# EAGLE design boil_buddy (EAGLE 9.6.2)
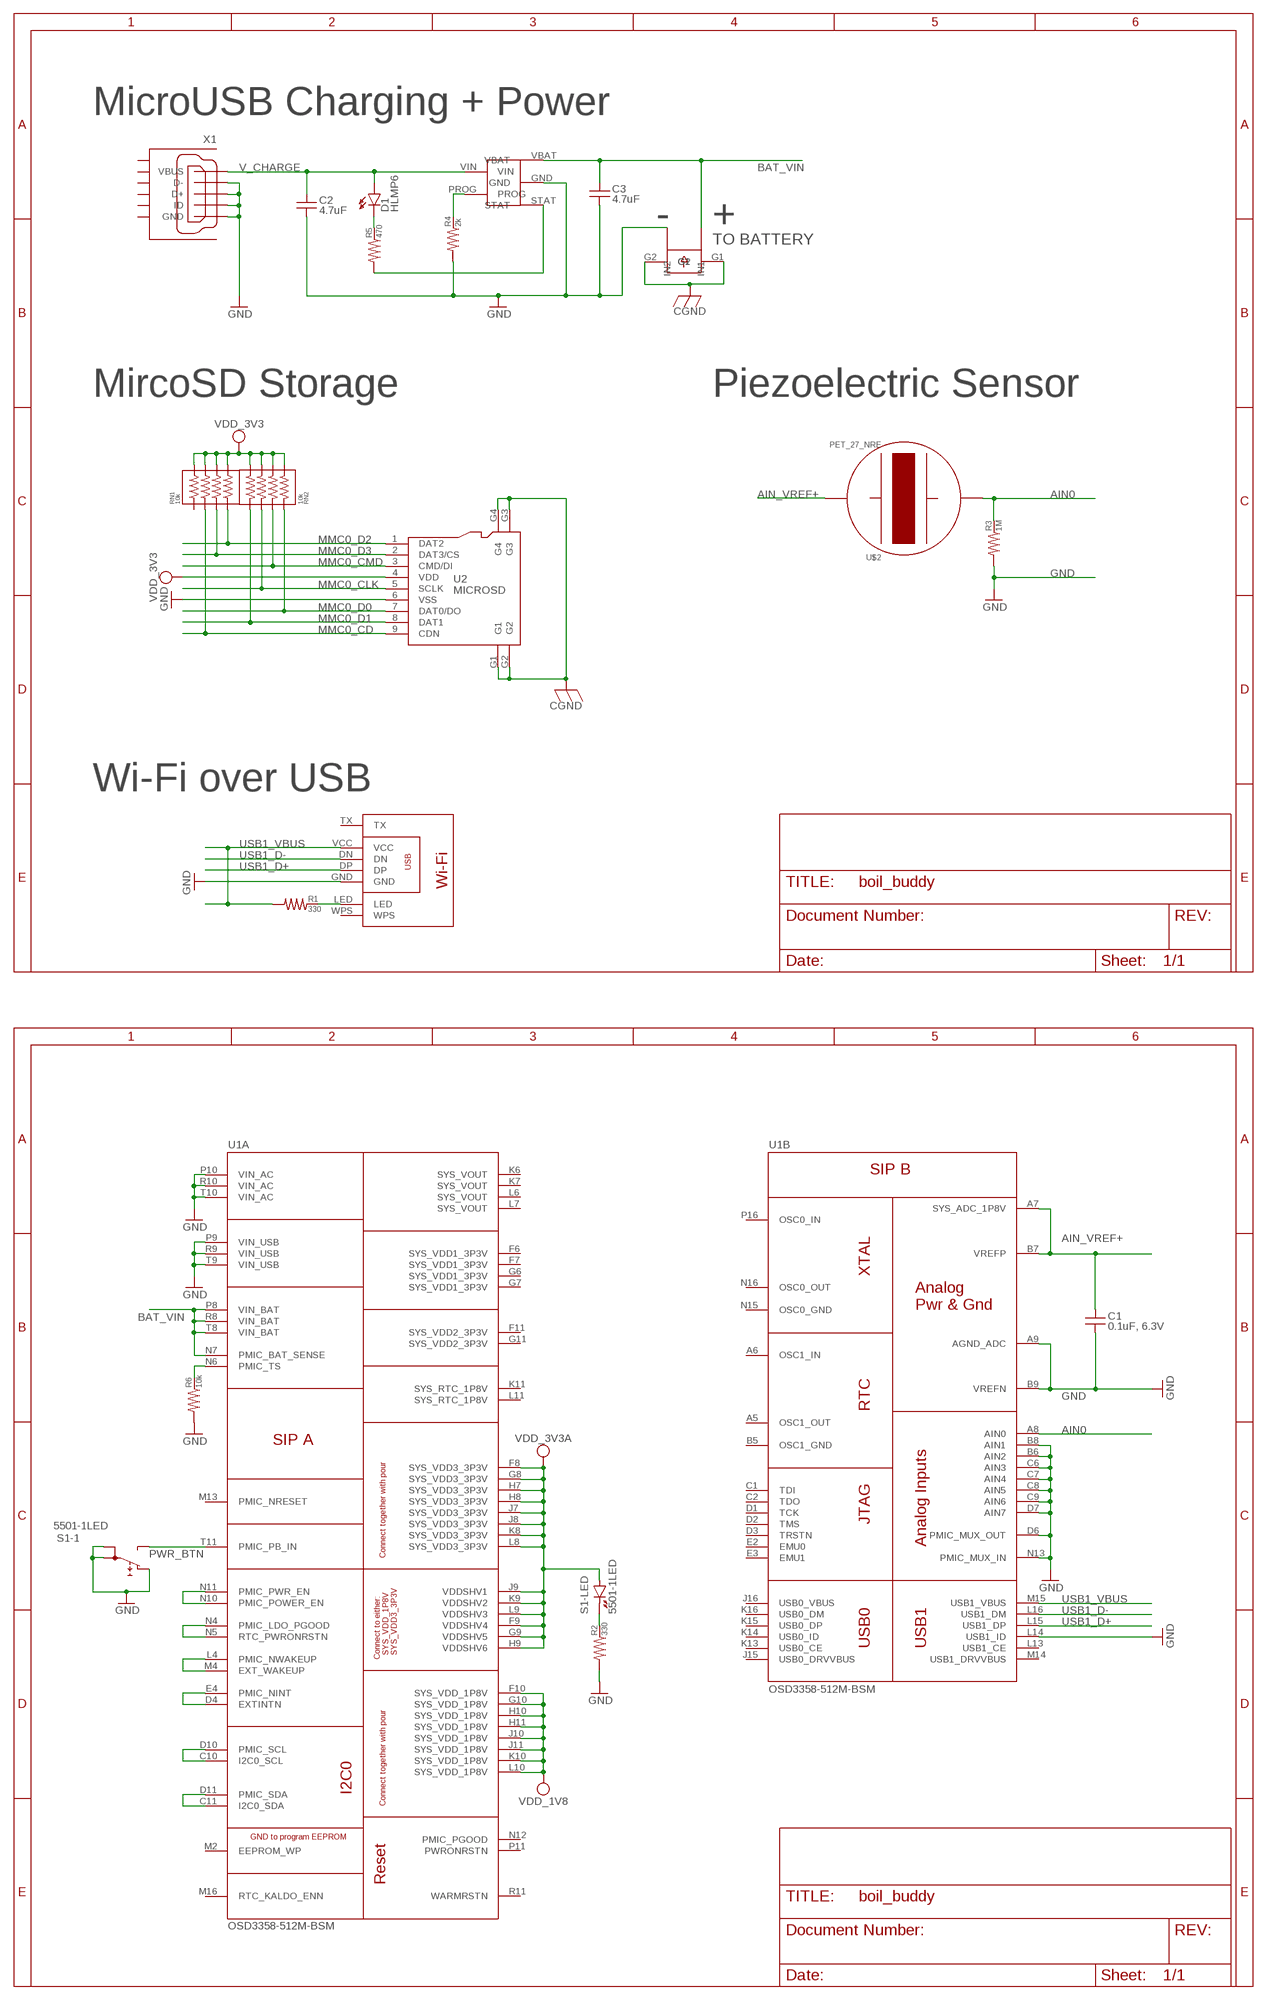
[diagram p0: schematic, sheet 1, part 1 of 2]
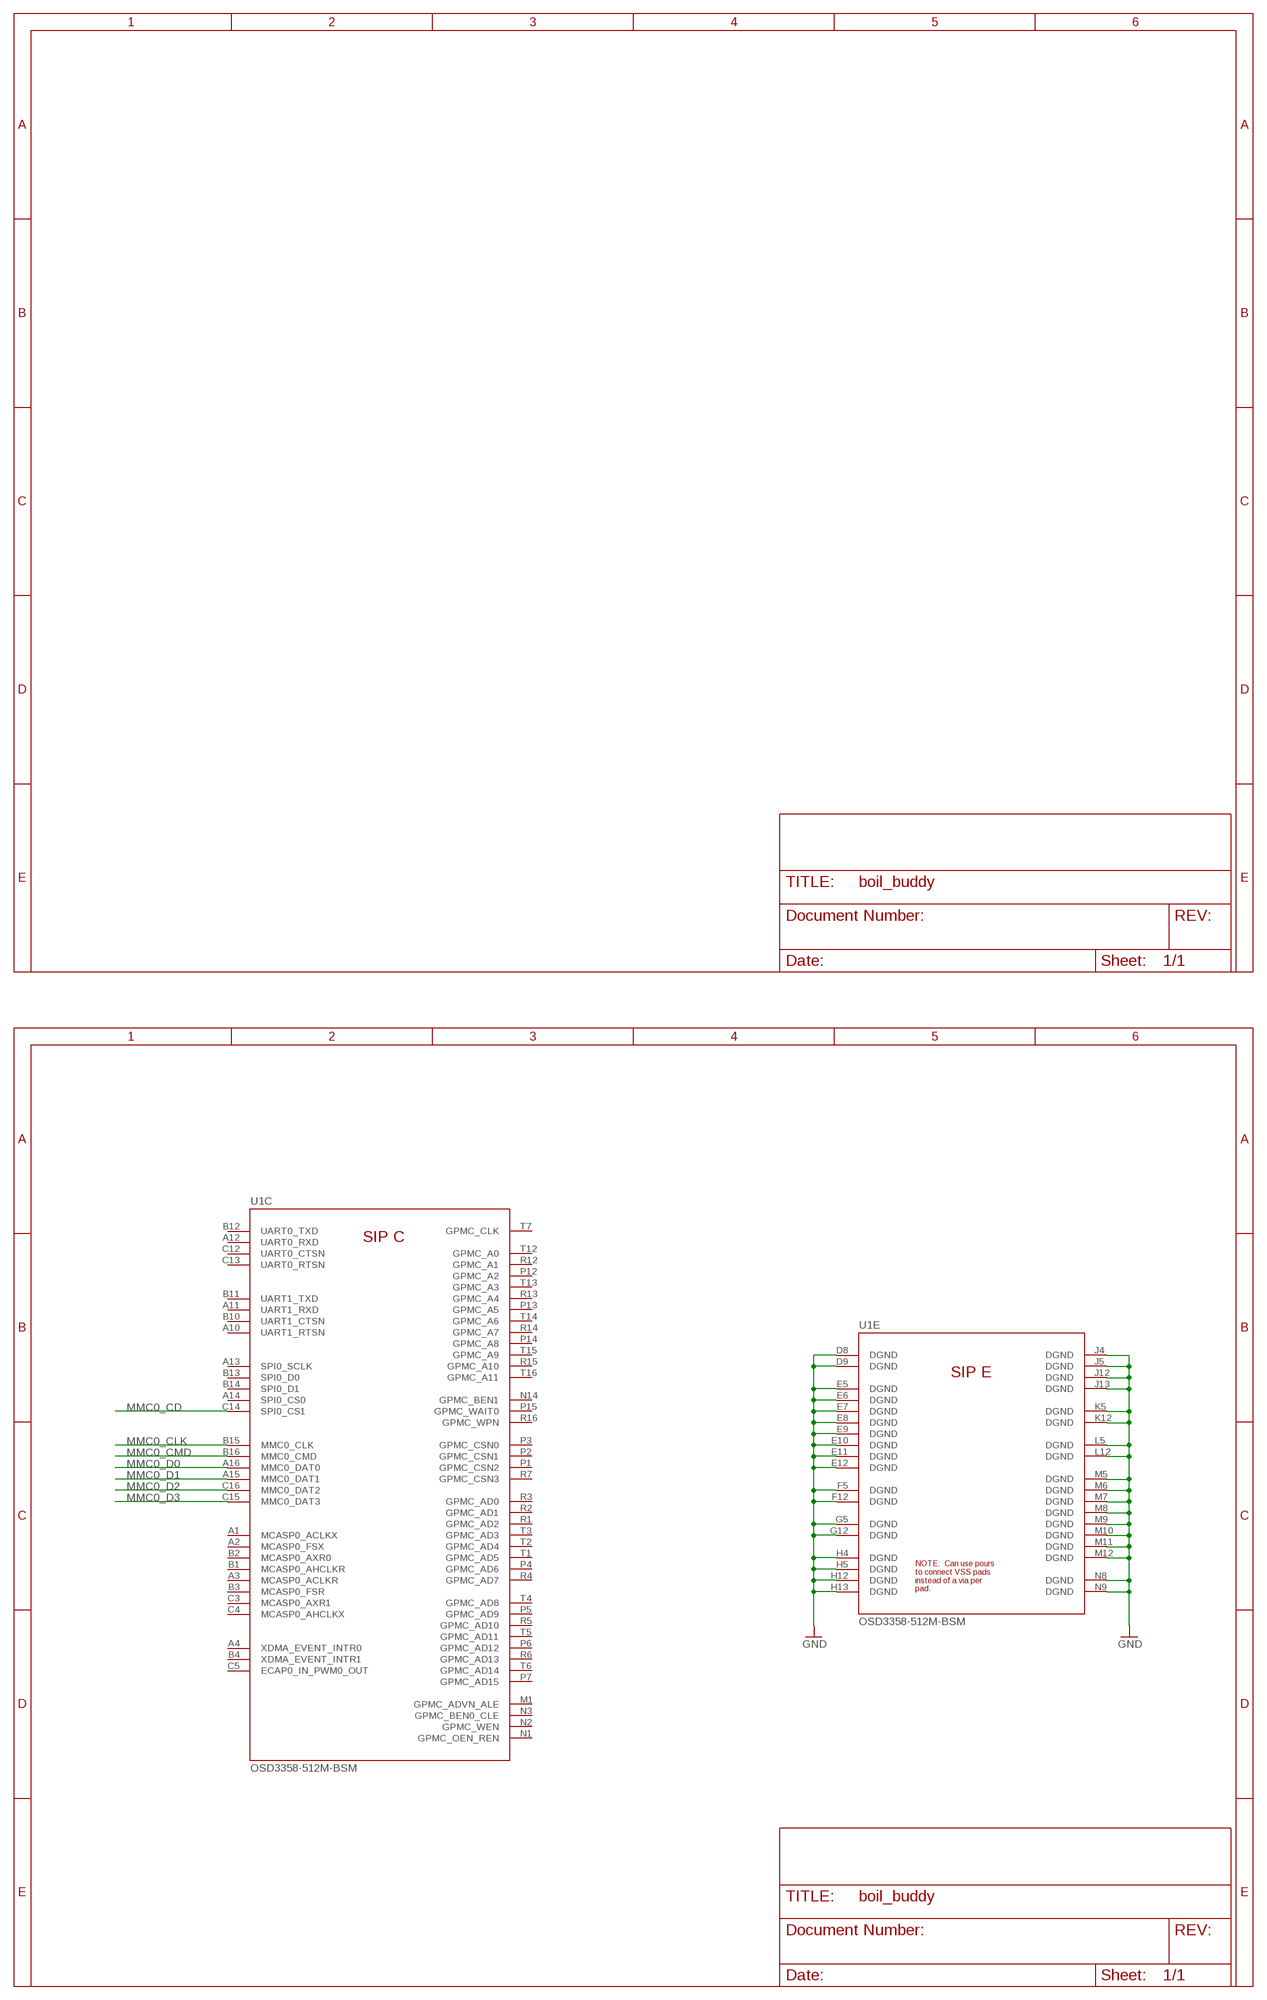
[diagram p1: schematic, sheet 1, part 2 of 2]

## Parts
C1  0.1uF, 6.3V  CAPACITOR-(INCH)-0402  [0402]
C2  4.7uF  CAPACITOR-(INCH)-0603  [0603]
C3  4.7uF  CAPACITOR-(INCH)-0603  [0603]
D1  HLMP6  [HLMP6]
R1  330  RESISTOR-(INCH)-0402  [0402]
R2  330  RESISTOR-(INCH)-0402  [0402]
R3  1M  RESISTOR-(INCH)-0402  [0402]
R4  2k  RESISTOR-(INCH)-0402  [0402]
R5  470  RESISTOR-(INCH)-0402  [0402]
R6  10k  RESISTOR-(INCH)-0402  [0402]
RN1  10k  RESISTOR.NETWORK-(4)  [RN0804]
RN2  10k  RESISTOR.NETWORK-(4)  [RN0804]
S1  5501-1LED  [5501-1LED]
U1  OSD3358-512M-BSM  [OSD335X-BGA-256]
U2  MICROSD  [MICROSD]
U$1  GWF-3M08_NRE  [GWF-3M08]
U$2  PET_27_NRE  [PET_27]
U$3  MCP73831_NRE  [MCP73831]
U$4  2PIN_NRE  [2PIN]
X1  10118192-0001LF  [10118192-0001LF(MICRO-USB-B-AMPHENOL-FCI)]

## Nets
AIN0: R3.2 U1.A8(B:AIN0) U$2.PIEZO
AIN_VREF+: C1.1 U1.A7(B:SYS_ADC_1P8V) U1.B7(B:VREFP) U$2.BRASS
BAT_VIN: C3.1 U1.N7(A:PMIC_BAT_SENSE) U1.P8(A:VIN_BAT) U1.R8(A:VIN_BAT) U1.T8(A:VIN_BAT) U$3.VBAT U$4.IN1
CGND: U2.G1 U2.G2 U2.G3 U2.G4 U$4.G1 U$4.G2
GND: C1.2 C2.2 C3.2 R2.1 R3.1 R4.1 R6.1 S1.1A(-1:1A) S1.1B(-1:1B) S1.NC(-1:NC) U1.A9(B:AGND_ADC) U1.B6(B:AIN2) U1.B8(B:AIN1) U1.B9(B:VREFN) U1.C6(B:AIN3) U1.C7(B:AIN4) U1.C8(B:AIN5) U1.C9(B:AIN6) U1.D6(B:PMIC_MUX_OUT) U1.D7(B:AIN7) U1.D8(E:DGND) U1.D9(E:DGND) U1.E5(E:DGND) U1.E6(E:DGND) U1.E7(E:DGND) U1.E8(E:DGND) U1.E9(E:DGND) U1.E10(E:DGND) U1.E11(E:DGND) U1.E12(E:DGND) U1.F5(E:DGND) U1.F12(E:DGND) U1.G5(E:DGND) U1.G12(E:DGND) U1.H4(E:DGND) U1.H5(E:DGND) U1.H12(E:DGND) U1.H13(E:DGND) U1.J4(E:DGND) U1.J5(E:DGND) U1.J12(E:DGND) U1.J13(E:DGND) U1.K5(E:DGND) U1.K12(E:DGND) U1.L5(E:DGND) U1.L12(E:DGND) U1.L14(B:USB1_ID) U1.M5(E:DGND) U1.M6(E:DGND) U1.M7(E:DGND) U1.M8(E:DGND) U1.M9(E:DGND) U1.M10(E:DGND) U1.M11(E:DGND) U1.M12(E:DGND) U1.N8(E:DGND) U1.N9(E:DGND) U1.N13(B:PMIC_MUX_IN) U1.P9(A:VIN_USB) U1.P10(A:VIN_AC) U1.R9(A:VIN_USB) U1.R10(A:VIN_AC) U1.T9(A:VIN_USB) U1.T10(A:VIN_AC) U2.6(VSS) U$1.GND U$3.GND U$4.IN2 X1.D+ X1.D- X1.GND X1.ID
MMC0_CD: RN1.2 U1.C14(C:SPI0_CS1) U2.9(CDN)
MMC0_CLK: RN2.3 U1.B15(C:MMC0_CLK) U2.5(SCLK)
MMC0_CMD: RN2.2 U1.B16(C:MMC0_CMD) U2.3(CMD/DI)
MMC0_D0: RN2.1 U1.A16(C:MMC0_DAT0) U2.7(DAT0/DO)
MMC0_D1: RN2.4 U1.A15(C:MMC0_DAT1) U2.8(DAT1)
MMC0_D2: RN1.4 U1.C16(C:MMC0_DAT2) U2.1(DAT2)
MMC0_D3: RN1.3 U1.C15(C:MMC0_DAT3) U2.2(DAT3/CS)
N$1: U1.N10(A:PMIC_POWER_EN) U1.N11(A:PMIC_PWR_EN)
N$2: U1.N4(A:PMIC_LDO_PGOOD) U1.N5(A:RTC_PWRONRSTN)
N$3: U1.L4(A:PMIC_NWAKEUP) U1.M4(A:EXT_WAKEUP)
N$4: U1.D4(A:EXTINTN) U1.E4(A:PMIC_NINT)
N$5: U1.C10(A:I2C0_SCL) U1.D10(A:PMIC_SCL)
N$6: U1.C11(A:I2C0_SDA) U1.D11(A:PMIC_SDA)
N$7: R2.2 S1.-(-LED:K)
N$8: R6.2 U1.N6(A:PMIC_TS)
N$9: D1.K R5.2
N$10: R5.1 U$3.STAT
N$11: R1.2 U$1.LED
N$12: R4.2 U$3.PROG
PWR_BTN: S1.NO(-1:NO) U1.T11(A:PMIC_PB_IN)
USB1_D+: U1.L15(B:USB1_DP) U$1.DP
USB1_D-: U1.L16(B:USB1_DM) U$1.DN
USB1_VBUS: R1.1 U1.M15(B:USB1_VBUS) U$1.VCC
V_CHARGE: C2.1 D1.A U$3.VIN X1.VBUS
VDD_1V8: U1.F10(A:SYS_VDD_1P8V) U1.G10(A:SYS_VDD_1P8V) U1.H10(A:SYS_VDD_1P8V) U1.H11(A:SYS_VDD_1P8V) U1.J10(A:SYS_VDD_1P8V) U1.J11(A:SYS_VDD_1P8V) U1.K10(A:SYS_VDD_1P8V) U1.L10(A:SYS_VDD_1P8V)
VDD_3V3A: RN1.5 RN1.6 RN1.7 RN1.8 RN2.5 RN2.6 RN2.7 RN2.8 S1.+(-LED:A) U1.F8(A:SYS_VDD3_3P3V) U1.F9(A:VDDSHV4) U1.G8(A:SYS_VDD3_3P3V) U1.G9(A:VDDSHV5) U1.H7(A:SYS_VDD3_3P3V) U1.H8(A:SYS_VDD3_3P3V) U1.H9(A:VDDSHV6) U1.J7(A:SYS_VDD3_3P3V) U1.J8(A:SYS_VDD3_3P3V) U1.J9(A:VDDSHV1) U1.K8(A:SYS_VDD3_3P3V) U1.K9(A:VDDSHV2) U1.L8(A:SYS_VDD3_3P3V) U1.L9(A:VDDSHV3) U2.4(VDD) ; supply symbol labelled VDD_3V3
Unconnected: RN1.1 U1.A1(C:MCASP0_ACLKX) U1.A2(C:MCASP0_FSX) U1.A3(C:MCASP0_ACLKR) U1.A4(C:XDMA_EVENT_INTR0) U1.A5(B:OSC1_OUT) U1.A6(B:OSC1_IN) U1.A10(C:UART1_RTSN) U1.A11(C:UART1_RXD) U1.A12(C:UART0_RXD) U1.A13(C:SPI0_SCLK) U1.A14(C:SPI0_CS0) U1.B1(C:MCASP0_AHCLKR) U1.B2(C:MCASP0_AXR0) U1.B3(C:MCASP0_FSR) U1.B4(C:XDMA_EVENT_INTR1) U1.B5(B:OSC1_GND) U1.B10(C:UART1_CTSN) U1.B11(C:UART1_TXD) U1.B12(C:UART0_TXD) U1.B13(C:SPI0_D0) U1.B14(C:SPI0_D1) U1.C1(B:TDI) U1.C2(B:TDO) U1.C3(C:MCASP0_AXR1) U1.C4(C:MCASP0_AHCLKX) U1.C5(C:ECAP0_IN_PWM0_OUT) U1.C12(C:UART0_CTSN) U1.C13(C:UART0_RTSN) U1.D1(B:TCK) U1.D2(B:TMS) U1.D3(B:TRSTN) U1.D5(F:CAP_VDD_RTC) U1.D12(F:NC) U1.D13(D:MDC) U1.D14(D:MII1_RXD3) U1.D15(D:MII1_RXD2) U1.D16(D:MII1_RXD1) U1.E1(D:LCD_AC_BIAS_EN) U1.E2(B:EMU0) U1.E3(B:EMU1) U1.E13(D:MDIO) U1.E14(D:MII1_RXD0) U1.E15(D:MII1_RX_ER) U1.E16(D:MII1_RX_CLK) U1.F1(D:LCD_PCLK) U1.F2(D:LCD_HSYNC) U1.F3(D:LCD_VSYNC) U1.F4(F:VDDS_DDR) U1.F13(F:VDD_MPU) U1.F14(D:MII1_CRS) U1.F15(D:MII1_COL) U1.F16(D:MII1_RX_DV) U1.G1(D:LCD_DATA2) U1.G2(D:LCD_DATA1) U1.G3(D:LCD_DATA0) U1.G4(F:VDD_CORE) U1.G13(F:VDDS_PLL) U1.G14(D:MII1_TX_EN) U1.G15(D:MII1_TXD3) U1.G16(D:MII1_TXD2) U1.H1(D:LCD_DATA5) U1.H2(D:LCD_DATA4) U1.H3(D:LCD_DATA3) U1.H6(F:VPP) U1.H14(D:MII1_TXD1) U1.H15(D:MII1_TXD0) U1.H16(D:MII1_TX_CLK) U1.J1(D:LCD_DATA8) U1.J2(D:LCD_DATA7) U1.J3(D:LCD_DATA6) U1.J6(F:NC) U1.J14(D:RMII1_REF_CLK) U1.J15(B:USB0_DRVVBUS) U1.J16(B:USB0_VBUS) U1.K1(D:LCD_DATA11) U1.K2(D:LCD_DATA10) U1.K3(D:LCD_DATA9) U1.K4(F:NC) U1.K13(B:USB0_CE) U1.K14(B:USB0_ID) U1.K15(B:USB0_DP) U1.K16(B:USB0_DM) U1.L1(D:LCD_DATA14) U1.L2(D:LCD_DATA13) U1.L3(D:LCD_DATA12) U1.L13(B:USB1_CE) U1.M1(C:GPMC_ADVN_ALE) U1.M2(A:EEPROM_WP) U1.M3(D:LCD_DATA15) U1.M13(A:PMIC_NRESET) U1.M14(B:USB1_DRVVBUS) U1.M16(A:RTC_KALDO_ENN) U1.N1(C:GPMC_OEN_REN) U1.N2(C:GPMC_WEN) U1.N3(C:GPMC_BEN0_CLE) U1.N12(A:PMIC_PGOOD) U1.N14(C:GPMC_BEN1) U1.N15(B:OSC0_GND) U1.N16(B:OSC0_OUT) U1.P1(C:GPMC_CSN2) U1.P2(C:GPMC_CSN1) U1.P3(C:GPMC_CSN0) U1.P4(C:GPMC_AD6) U1.P5(C:GPMC_AD9) U1.P6(C:GPMC_AD12) U1.P7(C:GPMC_AD15) U1.P11(A:PWRONRSTN) U1.P12(C:GPMC_A2) U1.P13(C:GPMC_A5) U1.P14(C:GPMC_A8) U1.P15(C:GPMC_WAIT0) U1.P16(B:OSC0_IN) U1.R1(C:GPMC_AD2) U1.R2(C:GPMC_AD1) U1.R3(C:GPMC_AD0) U1.R4(C:GPMC_AD7) U1.R5(C:GPMC_AD10) U1.R6(C:GPMC_AD13) U1.R7(C:GPMC_CSN3) U1.R11(A:WARMRSTN) U1.R12(C:GPMC_A1) U1.R13(C:GPMC_A4) U1.R14(C:GPMC_A7) U1.R15(C:GPMC_A10) U1.R16(C:GPMC_WPN) U1.T1(C:GPMC_AD5) U1.T2(C:GPMC_AD4) U1.T3(C:GPMC_AD3) U1.T4(C:GPMC_AD8) U1.T5(C:GPMC_AD11) U1.T6(C:GPMC_AD14) U1.T7(C:GPMC_CLK) U1.T12(C:GPMC_A0) U1.T13(C:GPMC_A3) U1.T14(C:GPMC_A6) U1.T15(C:GPMC_A9) U1.T16(C:GPMC_A11) U$1.TX U$1.WPS X1.CGND1(SGND1) X1.CGND2(SGND2) X1.CGND3(SGND3) X1.CGND4(SGND4) X1.CGND5(SGND5) X1.CGND6(SGND6)

## Notes on the sheet
- MicroUSB Charging + Power
- - | +
- TO BATTERY
- MircoSD Storage | Piezoelectric Sensor
- Wi-Fi over USB

## Power pins joined to a net without a drawn wire
SYS_RTC_1P8V: U1.K11(A:SYS_RTC_1P8V) U1.L11(A:SYS_RTC_1P8V)
SYS_VDD1_3P3V: U1.F6(A:SYS_VDD1_3P3V) U1.F7(A:SYS_VDD1_3P3V) U1.G6(A:SYS_VDD1_3P3V) U1.G7(A:SYS_VDD1_3P3V)
SYS_VDD2_3P3V: U1.F11(A:SYS_VDD2_3P3V) U1.G11(A:SYS_VDD2_3P3V)
SYS_VOUT: U1.K6(A:SYS_VOUT) U1.K7(A:SYS_VOUT) U1.L6(A:SYS_VOUT) U1.L7(A:SYS_VOUT)

## Library data of the parts
C1-C3 = boil_buddy:CAPACITOR-(INCH)-: Basic SMD ceramic capacitors
D1 = boil_buddy:HLMP6: LED 2mm horizontal; MF: AGILENT TECHNOLOGIES; MPN: HLMP-6500; OC_FARNELL: 1652490; OC_NEWARK: 40K0088
R1-R6 = boil_buddy:RESISTOR-(INCH)-: Basic SMD Resistors
RN1 RN2 = boil_buddy:RESISTOR.NETWORK-(4)
S1 = boil_buddy:55?-1LED: PUSHBUTTON SERIES 5500 SWITCHES 1 LED Source: www.e-switch.com .. 5500.pdf
U1 = boil_buddy:OSD3358-512M-BSM: Octavo Systems LLC OSD335x Family SiP: 21mm x 21mm, 1.27mm pitch 256 pin BGA contains AM3358, 512MB DDR3, TPS65217, TL5209, EEPROM and passives. Commerical Temperature: 0C to 85C.
U2 = boil_buddy:MICROSD
U$1 = boil_buddy:GWF-3M08_NRE
U$2 = boil_buddy:PET_27_NRE
U$3 = boil_buddy:MCP73831_NRE
U$4 = boil_buddy:2PIN_NRE
X1 = boil_buddy:10118192-0001LF: Amphenol FCI Micro USB Type B Complete Surface Mount (SMT) no guide holes

## Board
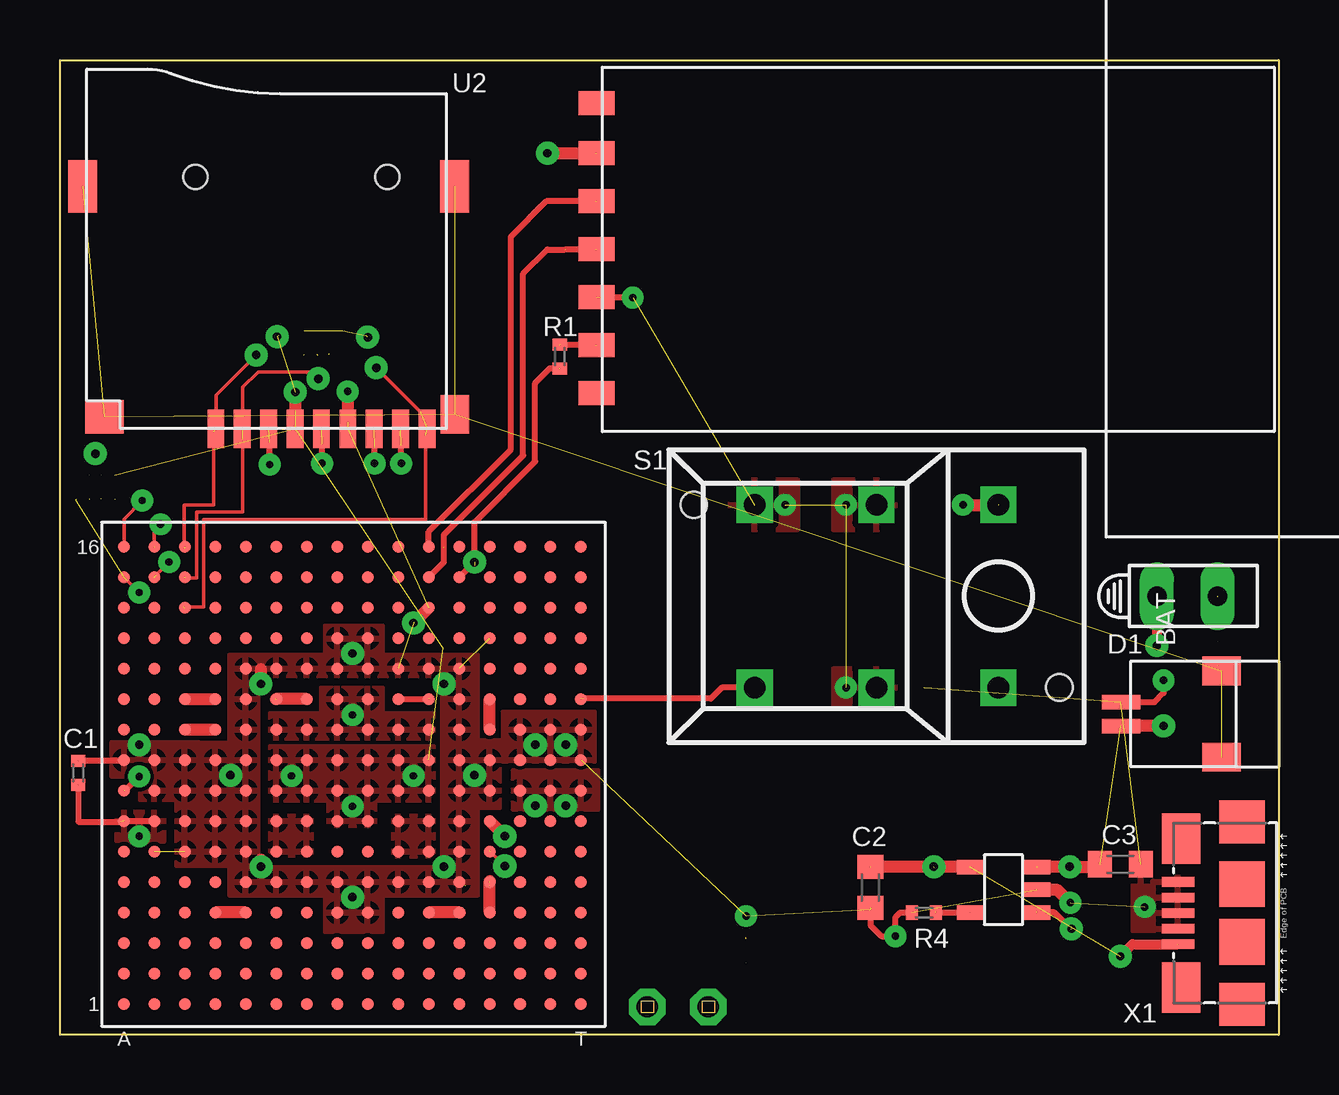
[diagram p2: board, top side]
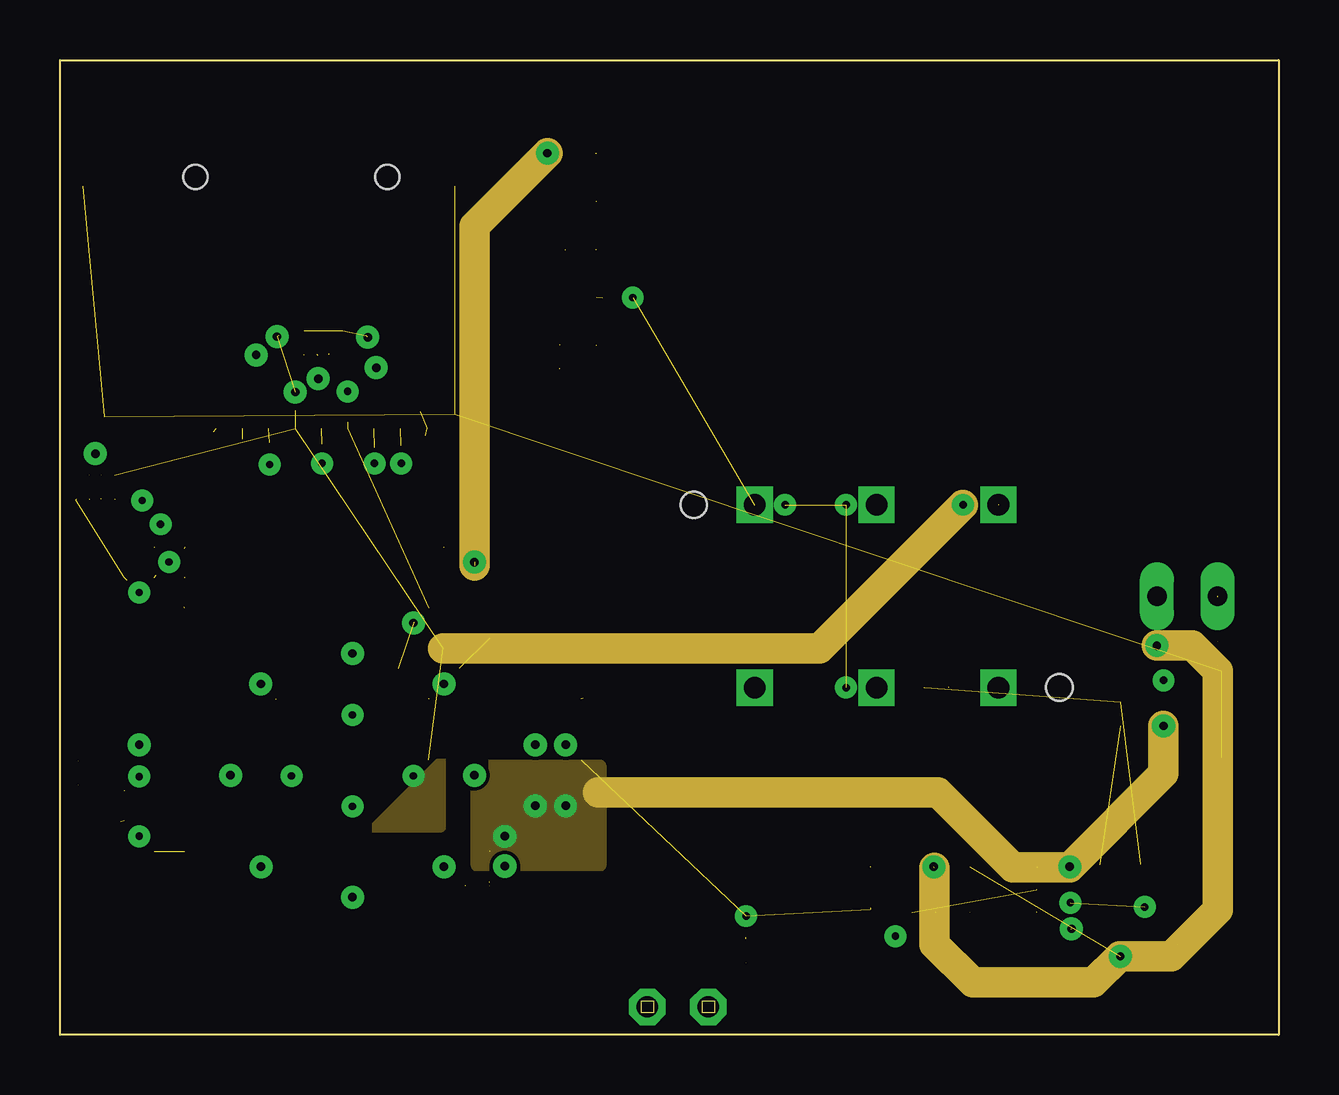
[diagram p3: board, inner layer Route2]
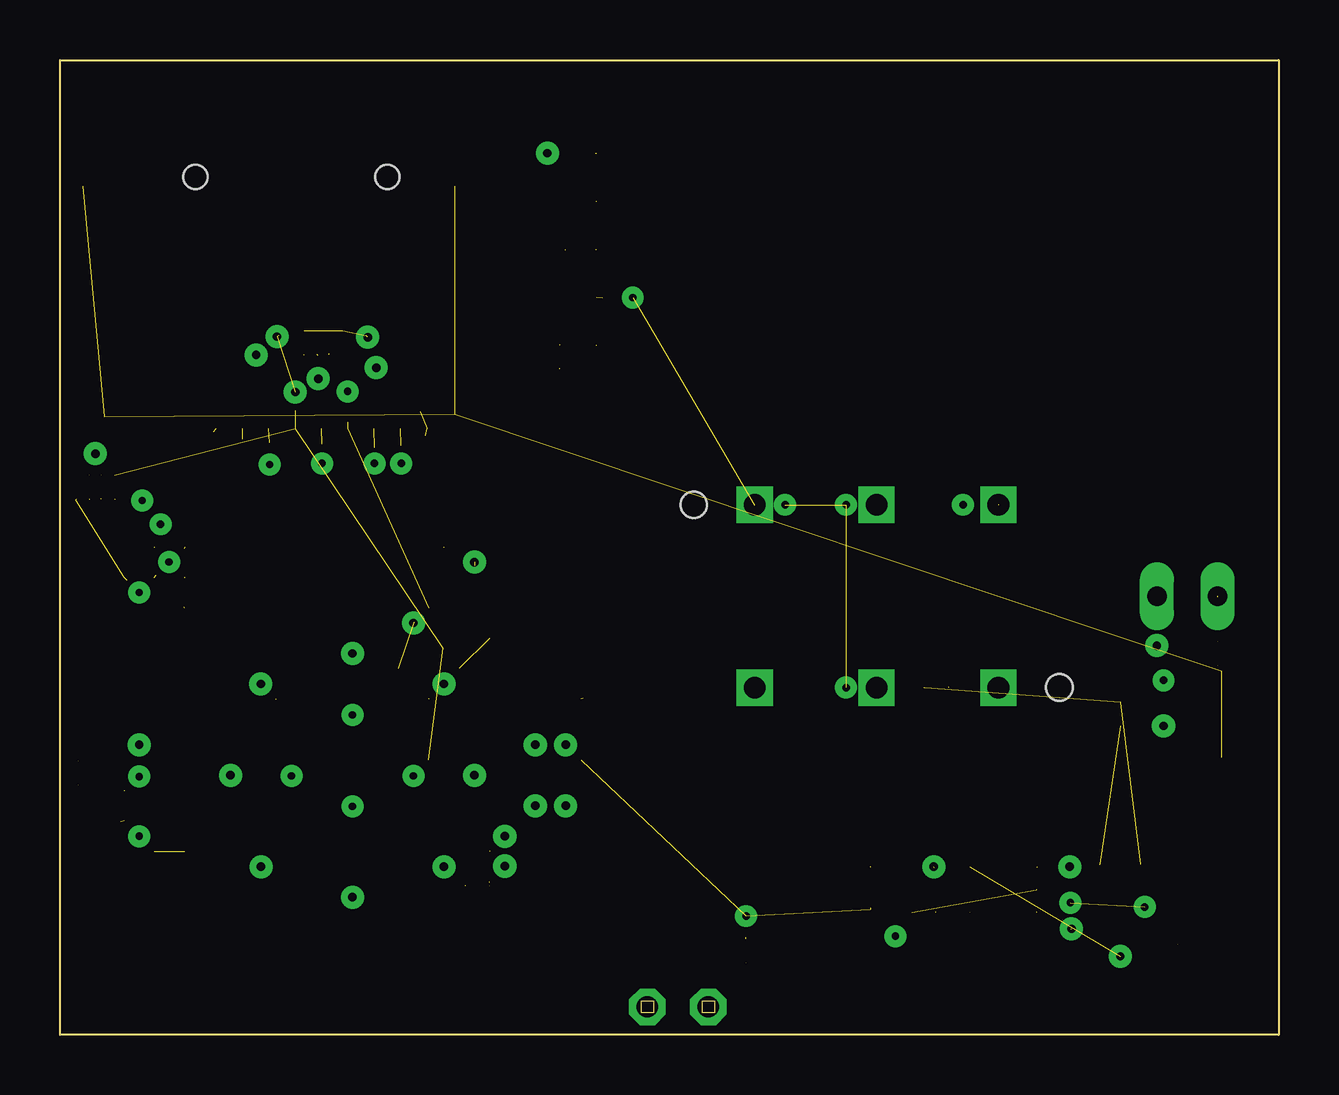
[diagram p4: board, inner layer Route15]
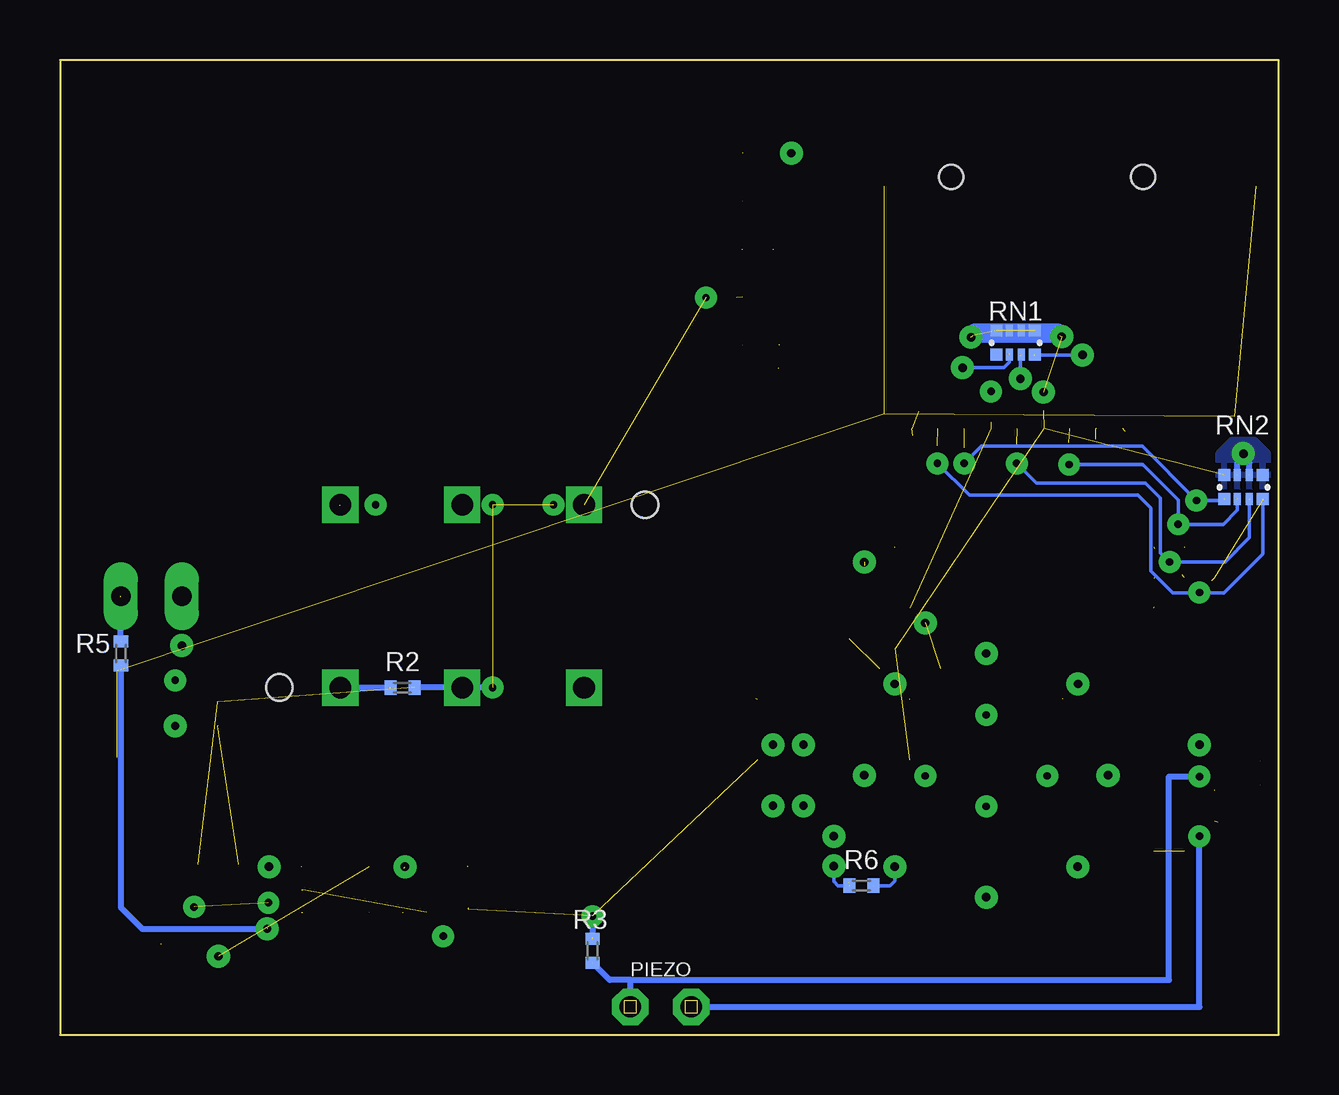
[diagram p5: board, bottom side, seen from below]

Size 50.8 x 40.64 mm. Coordinates in mm from the lower left corner, seen from the top.
Outline: 0,0 0,40.64 50.8,40.64 50.8,0 0,0
Copper layers (1*2*15*16): Top 0.035mm / dielectric 0.23mm / Route2 0.035mm / dielectric 0.93mm / Route15 0.035mm / dielectric 0.23mm / Bottom 0.035mm
Design rules "ENGI301_4lyr *": minimum track width 6mil, minimum drill 12mil, track to track 6mil, track to pad 6mil, pad to pad 6mil, via to via 6mil, smd to smd 6mil, copper to edge 10mil, drill to drill 12mil, minimum pad ring 12mil, minimum via ring 12mil, stop-mask expansion 3mil, vias tented up to drill 25mil, thermal gap 10mil

### Footprints (pad centres in the part's own frame; a part is rotated, then mirrored left to right if it is on the bottom)
0402 = smd 0.5 x 0.6: 1 -0.5,0; 2 0.5,0
0603 = smd 1 x 1.1: 1 -0.85,0; 2 0.85,0
HLMP6 = drill 0.813 long: A -1.27,0; K 1.27,0
RN0804 = smd 0.498 x 0.5: 1 -0.801,-0.5; 4 0.801,-0.5; 5 0.801,0.5; 8 -0.801,0.5 | smd 0.3 x 0.5: 2 -0.25,-0.5; 3 0.25,-0.5; 6 0.25,0.5; 7 -0.25,0.5
5501-1LED = drill 0.9 pad 1.5 square: 1A 0,3.81; 1B 0,-3.81; + -5.08,-3.81; - -5.08,3.81; NC 5.08,-3.81; NO 5.08,3.81 | hole 1.1: -7.62,3.81; 7.62,-3.81
OSD335X-BGA-256 = smd 0.5 x 0.5: A1 -9.525,-9.525; A2 -9.525,-8.255; A3 -9.525,-6.985; A4 -9.525,-5.715; A5 -9.525,-4.445; A6 -9.525,-3.175; A7 -9.525,-1.905; A8 -9.525,-0.635; A9 -9.525,0.635; A10 -9.525,1.905; A11 -9.525,3.175; A12 -9.525,4.445; A13 -9.525,5.715; A14 -9.525,6.985; A15 -9.525,8.255; A16 -9.525,9.525; B1 -8.255,-9.525; B2 -8.255,-8.255; B3 -8.255,-6.985; B4 -8.255,-5.715; B5 -8.255,-4.445; B6 -8.255,-3.175; B7 -8.255,-1.905; B8 -8.255,-0.635; B9 -8.255,0.635; B10 -8.255,1.905; B11 -8.255,3.175; B12 -8.255,4.445; B13 -8.255,5.715; B14 -8.255,6.985; B15 -8.255,8.255; B16 -8.255,9.525; C1 -6.985,-9.525; C2 -6.985,-8.255; C3 -6.985,-6.985; C4 -6.985,-5.715; C5 -6.985,-4.445; C6 -6.985,-3.175; C7 -6.985,-1.905; C8 -6.985,-0.635; C9 -6.985,0.635; C10 -6.985,1.905; C11 -6.985,3.175; C12 -6.985,4.445; C13 -6.985,5.715; C14 -6.985,6.985; C15 -6.985,8.255; C16 -6.985,9.525; D1 -5.715,-9.525; D2 -5.715,-8.255; D3 -5.715,-6.985; D4 -5.715,-5.715; D5 -5.715,-4.445; D6 -5.715,-3.175; D7 -5.715,-1.905; D8 -5.715,-0.635; D9 -5.715,0.635; D10 -5.715,1.905; D11 -5.715,3.175; D12 -5.715,4.445; D13 -5.715,5.715; D14 -5.715,6.985; D15 -5.715,8.255; D16 -5.715,9.525; E1 -4.445,-9.525; E2 -4.445,-8.255; E3 -4.445,-6.985; E4 -4.445,-5.715; E5 -4.445,-4.445; E6 -4.445,-3.175; E7 -4.445,-1.905; E8 -4.445,-0.635; E9 -4.445,0.635; E10 -4.445,1.905; E11 -4.445,3.175; E12 -4.445,4.445; E13 -4.445,5.715; E14 -4.445,6.985; E15 -4.445,8.255; E16 -4.445,9.525; F1 -3.175,-9.525; F2 -3.175,-8.255; F3 -3.175,-6.985; F4 -3.175,-5.715; F5 -3.175,-4.445; F6 -3.175,-3.175; F7 -3.175,-1.905; F8 -3.175,-0.635; F9 -3.175,0.635; F10 -3.175,1.905; F11 -3.175,3.175; F12 -3.175,4.445; F13 -3.175,5.715; F14 -3.175,6.985; F15 -3.175,8.255; F16 -3.175,9.525; G1 -1.905,-9.525; G2 -1.905,-8.255; G3 -1.905,-6.985; G4 -1.905,-5.715; G5 -1.905,-4.445; G6 -1.905,-3.175; G7 -1.905,-1.905; G8 -1.905,-0.635; G9 -1.905,0.635; G10 -1.905,1.905; G11 -1.905,3.175; G12 -1.905,4.445; G13 -1.905,5.715; G14 -1.905,6.985; G15 -1.905,8.255; G16 -1.905,9.525; H1 -0.635,-9.525; H2 -0.635,-8.255; H3 -0.635,-6.985; H4 -0.635,-5.715; H5 -0.635,-4.445; H6 -0.635,-3.175; H7 -0.635,-1.905; H8 -0.635,-0.635; H9 -0.635,0.635; H10 -0.635,1.905; H11 -0.635,3.175; H12 -0.635,4.445; H13 -0.635,5.715; H14 -0.635,6.985; H15 -0.635,8.255; H16 -0.635,9.525; J1 0.635,-9.525; J2 0.635,-8.255; J3 0.635,-6.985; J4 0.635,-5.715; J5 0.635,-4.445; J6 0.635,-3.175; J7 0.635,-1.905; J8 0.635,-0.635; J9 0.635,0.635; J10 0.635,1.905; J11 0.635,3.175; J12 0.635,4.445; J13 0.635,5.715; J14 0.635,6.985; J15 0.635,8.255; J16 0.635,9.525; K1 1.905,-9.525; K2 1.905,-8.255; K3 1.905,-6.985; K4 1.905,-5.715; K5 1.905,-4.445; K6 1.905,-3.175; K7 1.905,-1.905; K8 1.905,-0.635; K9 1.905,0.635; K10 1.905,1.905; K11 1.905,3.175; K12 1.905,4.445; K13 1.905,5.715; K14 1.905,6.985; K15 1.905,8.255; K16 1.905,9.525; L1 3.175,-9.525; L2 3.175,-8.255; L3 3.175,-6.985; L4 3.175,-5.715; L5 3.175,-4.445; L6 3.175,-3.175; L7 3.175,-1.905; L8 3.175,-0.635; L9 3.175,0.635; L10 3.175,1.905; L11 3.175,3.175; L12 3.175,4.445; L13 3.175,5.715; L14 3.175,6.985; L15 3.175,8.255; L16 3.175,9.525; M1 4.445,-9.525; M2 4.445,-8.255; M3 4.445,-6.985; M4 4.445,-5.715; M5 4.445,-4.445; M6 4.445,-3.175; M7 4.445,-1.905; M8 4.445,-0.635; M9 4.445,0.635; M10 4.445,1.905; M11 4.445,3.175; M12 4.445,4.445; M13 4.445,5.715; M14 4.445,6.985; M15 4.445,8.255; M16 4.445,9.525; N1 5.715,-9.525; N2 5.715,-8.255; N3 5.715,-6.985; N4 5.715,-5.715; N5 5.715,-4.445; N6 5.715,-3.175; N7 5.715,-1.905; N8 5.715,-0.635; N9 5.715,0.635; N10 5.715,1.905; N11 5.715,3.175; N12 5.715,4.445; N13 5.715,5.715; N14 5.715,6.985; N15 5.715,8.255; N16 5.715,9.525; P1 6.985,-9.525; P2 6.985,-8.255; P3 6.985,-6.985; P4 6.985,-5.715; P5 6.985,-4.445; P6 6.985,-3.175; P7 6.985,-1.905; P8 6.985,-0.635; P9 6.985,0.635; P10 6.985,1.905; P11 6.985,3.175; P12 6.985,4.445; P13 6.985,5.715; P14 6.985,6.985; P15 6.985,8.255; P16 6.985,9.525; R1 8.255,-9.525; R2 8.255,-8.255; R3 8.255,-6.985; R4 8.255,-5.715; R5 8.255,-4.445; R6 8.255,-3.175; R7 8.255,-1.905; R8 8.255,-0.635; R9 8.255,0.635; R10 8.255,1.905; R11 8.255,3.175; R12 8.255,4.445; R13 8.255,5.715; R14 8.255,6.985; R15 8.255,8.255; R16 8.255,9.525; T1 9.525,-9.525; T2 9.525,-8.255; T3 9.525,-6.985; T4 9.525,-5.715; T5 9.525,-4.445; T6 9.525,-3.175; T7 9.525,-1.905; T8 9.525,-0.635; T9 9.525,0.635; T10 9.525,1.905; T11 9.525,3.175; T12 9.525,4.445; T13 9.525,5.715; T14 9.525,6.985; T15 9.525,8.255; T16 9.525,9.525
MICROSD = smd 1.6 x 0.7: 1 0,4.4; 2 0,3.3; 3 0,2.2; 4 0,1.1; 5 0,0; 6 0,-1.1; 7 0,-2.2; 8 0,-3.3; 9 0,-4.4 | smd 1.6 x 1.2: G1 0.6,-5.56 | smd 2.2 x 1.2: G2 10.1,-5.55; G3 10.1,9.95 | smd 1.4 x 1.6: G4 0.5,9.05 | hole 1: 10.5,-2.75; 10.5,5.25
GWF-3M08 = smd 1.5 x 1: DN -0.25,9.6; DP -0.25,7.6; GND -0.25,5.6; LED -0.25,3.6; TX -0.25,13.7; VCC -0.25,11.6; WPS -0.25,1.6
PET_27 = drill 0.889 pad 1.524 octagon: BRASS 2.54,0; PIEZO 0,0
MCP73831 = smd 0.6 x 1.1: GND 1.25,0.55; PROG 0.3,3.35; STAT 0.3,0.55; VBAT 2.2,0.55; VIN 2.2,3.35
2PIN = smd 1.2 x 1.6: G1 0.4,0.6; G2 4,0.6 | smd 0.6 x 1.6: IN1 1.7,4.8; IN2 2.7,4.8
10118192-0001LF(MICRO-USB-B-AMPHENOL-FCI) = smd 1.8 x 1.9: CGND1 -3.8,0; CGND4 3.8,0 | smd 1.9 x 1.9: CGND2 -1.2,0; CGND3 1.2,0 | smd 2.1 x 1.6: CGND5 3.1,2.55; CGND6 -3.1,2.55 | smd 0.4 x 1.35: D+ 0,2.675; D- -0.65,2.675; GND 1.3,2.675; ID 0.65,2.675; VBUS -1.3,2.675

### Placement (x,y rotation side)
C1  0.76,10.92 90 top
C2  33.78,6.15 270 top
C3  44.2,7.11 0 top
D1  46.99,18.29 0 top
R1  20.83,28.27 90 top
R2  36.53,14.48 180 bottom
R3  28.6,3.51 270 bottom
R4  36.02,5.11 0 top
R5  48.26,15.9 90 bottom
R6  17.4,6.22 180 bottom
RN1  10.97,28.85 0 bottom
RN2  1.47,22.83 0 bottom
S1  34.04,18.29 180 top
U1  12.19,10.82 0 top
U2  10.9,25.27 90 top
U$1  22.61,25.15 0 top
U$2  27.03,1.17 0 bottom
U$3  41.27,4.8 90 top
U$4  49.02,11.18 90 top
X1  49.28,5.08 90 top

### Tracks (layer width: path | path; a pad name or v marks a point on that pad's centre or on a via)
AIN0  (via drill 0.3 pad 0.61)  (2 unrouted)
  Top 0.254: v3.3,10.77 2.72,10.19 2.69,10.19
  Bottom 0.254: U$2.PIEZO 27.03,2.29 | 27.03,2.29 4.57,2.29 4.57,10.77 v3.3,10.77 | 27.03,2.29 27.89,2.29 28.6,3
AIN_VREF+  (via drill 0.3 pad 0.61)  (2 unrouted)
  Top 0.254: U1.A7 U1.B7 | C1.1 0.76,8.89 2.54,8.89
  Bottom 0.254: U$2.BRASS 3.3,1.17 v3.3,8.28
  pour Top: 2.39,9.25 2.39,8.08 4.32,8.08 4.32,9.25
BAT_VIN  (via drill 0.35)  (4 unrouted)
  Top 0.508: v46,12.88 44.2,12.88 | 43.13,6.91 43.23,7.01 | 40.74,7.01 v42.09,7.01 43.23,7.01 | 43.23,7.01 43.36,7.14 | v18.54,8.28 U1.N7
  Route2 1.27: v46,12.88 46,10.9 42.09,6.99 39.73,6.99 36.6,10.11 22.43,10.11
  other vias: 19.81,9.55 21.08,9.55
  pour Top: 18.87,11.05 18.87,9.37 22.45,9.37 22.45,11.05
  pour Route2: 22.53,11.23 22.53,7.06 17.37,7.06 17.37,11.23
CGND  (5 unrouted)
GND  (via drill 0.3 pad 0.61, 0.35)  (24 unrouted)
  Top 0.254: v23.88,30.73 22.61,30.73 | 11.99,25.55 11.99,25.96 | 3.28,12.06 v3.3,12.09 | 2.54,11.43 C1.2 | v46,14.78 46,14.25 45.62,13.87 44.22,13.87 | 33.78,5.23 33.78,4.57 34.24,4.12 v34.82,4.12 34.82,4.9 35.03,5.11 R4.1
  Top 0.508: U1.L14 14.76,17.2 | 8.38,7.32 8.38,6.86 | 8.38,14.63 8.38,15.24 | v11.99,26.82 11.99,25.96 | v42.11,5.51 41.58,6.04 40.69,6.04
  Bottom 0.152: R6.1 16.2,6.22 16,6.43 v16,7.01
  Bottom 0.254: v28.6,4.95 28.6,4.06 | v32.77,14.48 36.02,14.48
  other vias: 30.23,22.1 32.77,22.1 45.21,5.33 14.73,17.17 12.19,15.9 17.27,10.82 12.19,5.74 7.11,10.82 8.38,7.01 16,14.63 8.37,14.63 19.81,12.09 21.08,12.09
  pour Top: 8.59,7.01 15.9,7.01 15.9,14.94 8.28,14.94 8.28,5.79 7.06,5.79 7.06,9.75 5.84,9.75 5.84,12.19 7.06,12.19 7.06,15.85 11.02,15.85 11.02,17.07 13.46,17.07 13.46,15.85 17.42,15.85 17.42,12.19 18.34,12.19 18.34,9.45 17.42,9.45 17.42,5.79 13.46,5.79 13.46,4.27 11.02,4.27 11.02,5.79 8.59,5.79
  pour Top: 7.06,5.79 9.5,5.79 9.5,7.01 7.06,7.01
  cutout Route15: -2.54,43.18 -2.54,-2.54 53.34,-2.54 53.34,20.32 43.18,20.32 43.18,43.18
  pour Top: 27.94,23.11 27.94,21.08 30.73,21.08 30.73,23.11 28.19,23.11
  pour Top: 32.26,23.11 32.26,21.08 34.8,21.08 34.8,23.11
  pour Top: 34.8,15.24 32.26,15.24 32.26,13.72 34.8,13.72
  pour Top: 47.24,6.6 47.24,4.32 44.7,4.32 44.7,6.6
  pour Top: 7.11,7.04 4.85,7.04 4.85,9.78 3.33,9.78 3.33,10.74 2.13,10.74 2.13,12.22 5.79,12.22 5.79,10.16 7.11,10.16
  pour Top: 17.4,12.29 17.4,11.38 22.3,11.38 22.3,13.49 18.44,13.49 18.44,12.29
MMC0_CD  (via drill 0.35)  (4 unrouted)
  Top 0.152: 5.18,17.83 5.99,17.83 5.99,21.49 15.24,21.49 15.24,24.99 | v13.18,27.81 15.01,25.98
  Bottom 0.152: 11.23,28.4 11.23,28.04 11.46,27.81 v13.18,27.81
MMC0_CLK  (via drill 0.3 pad 0.61)  (3 unrouted)
  Top 0.152: v4.55,19.71 4.01,19.18
  Top 0.254: v10.92,23.82 10.92,24.64
  Bottom 0.152: v10.92,23.82 10.11,23.01 5.56,23.01 4.93,22.38 4.93,20.09 v4.55,19.71 2.23,19.71 1.22,20.73 RN2.3
MMC0_CMD  (via drill 0.3 pad 0.61)  (3 unrouted)
  Top 0.152: v4.19,21.29 3.94,21.03 3.94,20.32
  Top 0.254: v8.74,23.77 8.74,24.69
  Bottom 0.152: 1.73,22.35 1.73,21.87 2.31,21.29 v4.19,21.29 4.19,22.3 5.66,23.77 v8.74,23.77
MMC0_D0  (via drill 0.3 pad 0.61)  (2 unrouted)
  Top 0.152: v3.43,22.28 2.67,21.51 U1.A16
  Top 0.254: v13.11,23.82 13.11,24.49
  Bottom 0.152: v13.11,23.82 12.39,24.54 5.69,24.54 v3.43,22.28 2.34,22.28 2.29,22.33
MMC0_D1  (via drill 0.3 pad 0.61)  (4 unrouted)
  Top 0.152: v3.3,18.44 2.79,18.95
  Top 0.254: v14.22,23.82 14.22,24.56
  Bottom 0.152: v14.22,23.82 12.9,22.5 5.87,22.5 5.33,21.97 5.33,19.33 4.42,18.41 2.29,18.41 0.66,20.04 0.66,22.3
MMC0_D2  (via drill 0.35)  (4 unrouted)
  Top 0.152: 6.4,25.15 6.4,22.1 5.18,22.1 5.18,20.27 | U2.1 6.5,26.67 v8.18,28.35
  Bottom 0.152: v8.18,28.35 10.19,28.35
MMC0_D3  (via drill 0.35)  (4 unrouted)
  Top 0.152: 5.18,19.05 5.69,19.05 5.69,21.79 7.62,21.79 7.62,24.84 | v10.77,27.36 10.49,27.64 8.26,27.64 7.62,27 7.62,25.27
  Bottom 0.152: 10.77,28.32 v10.77,27.36
N$1
  Top 0.508: U1.N10 U1.N11
N$2  (1 unrouted)
  Top 0.254: U1.N4 17.91,6.35
  Top 0.508: U1.N4 17.91,6.4
N$3
  Top 0.254: U1.L4 U1.M4
  Top 0.508: 16.66,5.11 U1.L4
N$4
  Top 0.508: U1.E4 U1.D4
N$5
  Top 0.254: U1.C10 6.45,12.72
  Top 0.508: U1.C10 U1.D10
N$6
  Top 0.254: U1.D11 6.5,13.99
  Top 0.508: U1.C11 U1.D11
N$7  (1 unrouted)
  Bottom 0.254: S1.- 37.06,14.48
N$8  (via drill 0.35)  (2 unrouted)
  Top 0.152: v18.54,7.04 17.91,7.67
  Bottom 0.152: v18.54,7.04 18.54,6.4 18.36,6.22 R6.2
N$9  (2 unrouted)
  Bottom 0.254: R5.2 48.26,18.26
N$10  (via drill 0.35)  (3 unrouted)
  Top 0.254: 42.14,4.42 41.45,5.11 40.69,5.11
  Bottom 0.254: R5.1 48.26,5.31 47.37,4.42 v42.16,4.42
N$11  (2 unrouted)
  Top 0.254: U$1.LED 20.83,28.75
N$12  (2 unrouted)
  Top 0.254: 36.5,5.11 U$3.PROG
PWR_BTN  (1 unrouted)
  Top 0.254: S1.NO 27.58,14.48 27.13,14.02 21.79,14.02
SYS_RTC_1P8V  (1 unrouted)
  Top 0.254: U1.K11 15.39,13.99
SYS_VDD1_3P3V
  pour Top: 8.74,9.14 8.74,7.47 10.52,7.47 10.52,9.14
SYS_VDD2_3P3V  (1 unrouted)
  Top 0.508: U1.G11 8.99,13.99
SYS_VOUT
  pour Top: 13.87,9.14 13.87,7.42 15.6,7.42 15.6,9.14
USB1_D+  (3 unrouted)
  Top 0.254: U1.L15 16,19.71 16,20.32 | 16,20.34 16,20.85 19.3,24.16 19.3,31.73 20.32,32.74 21.06,32.74 | U$1.DP 21.08,32.74
USB1_D-  (1 unrouted)
  Top 0.254: U1.L16 15.37,20.98 18.8,24.41 18.8,33.27 20.27,34.75 U$1.DN
USB1_VBUS  (via drill 0.35)  (3 unrouted)
  Top 0.254: U1.M15 v17.27,19.71 17.27,21.36 19.81,23.9 19.81,27.18 20.42,27.79 20.85,27.79
  Top 0.508: v20.32,36.75 22.33,36.75
  Route2 1.27: v20.32,36.75 17.27,33.71 17.27,19.56
V_CHARGE  (via drill 0.35)  (5 unrouted)
  Top 0.406: D1.A v45.72,16.23 | v44.2,3.28 44.7,3.79 46.58,3.79
  Top 0.508: U$3.VIN v36.42,7.01 33.83,7.01 33.81,7.04
  Route2 1.27: v45.72,16.23 47.19,16.23 48.26,15.16 48.26,5.21 46.33,3.28 44.17,3.28 43.08,2.18 38.05,2.18 36.45,3.79 36.45,6.96
VDD_1V8  (via drill 0.3 pad 0.61)
  other vias: 12.19,13.34
  pour Top: 8.74,12.34 15.6,12.34 15.6,13.41 13.46,13.41 13.46,14.48 10.87,14.48 10.87,13.41 8.74,13.41
VDD_3V3A  (via drill 0.3 pad 0.61, 0.35)  (14 unrouted)
  Top 0.254: v37.64,22.1 39.01,22.1
  Top 0.508: v9.8,26.8 9.8,26.04 | v37.64,22.1 39.14,22.1
  Route2 1.27: v37.64,22.1 31.65,16.1 15.98,16.1
  Bottom 0.254: 1.22,23.34 1.22,23.85 | 1.73,23.34 1.73,23.82
  Bottom 0.813: 9.12,29.16 9.22,29.26 12.65,29.26 12.75,29.16
  other vias: 12.19,9.53 14.73,10.79 9.65,10.79 1.47,24.23 12.83,29.08 9.04,29.11
  pour Top: 8.74,11.73 15.6,11.73 15.6,9.91 13,9.91 13,8.69 11.33,8.69 11.33,9.91 8.74,9.91
  pour Top: 8.74,12.04 15.6,12.04 15.6,9.75 13.16,9.75 13.16,8.69 11.18,8.69 11.18,9.75 8.74,9.75
  pour Route2: 8.69,12.04 8.69,8.69 15.85,8.69 15.85,12.04
  pour Bottom: 0.46,22.83 2.49,22.83 2.49,24.28 1.96,24.82 1.02,24.82 0.46,24.26
  cutout Route2: 15.98,11.96 12.57,8.56 0.46,8.56 0.46,30.73 15.98,30.73